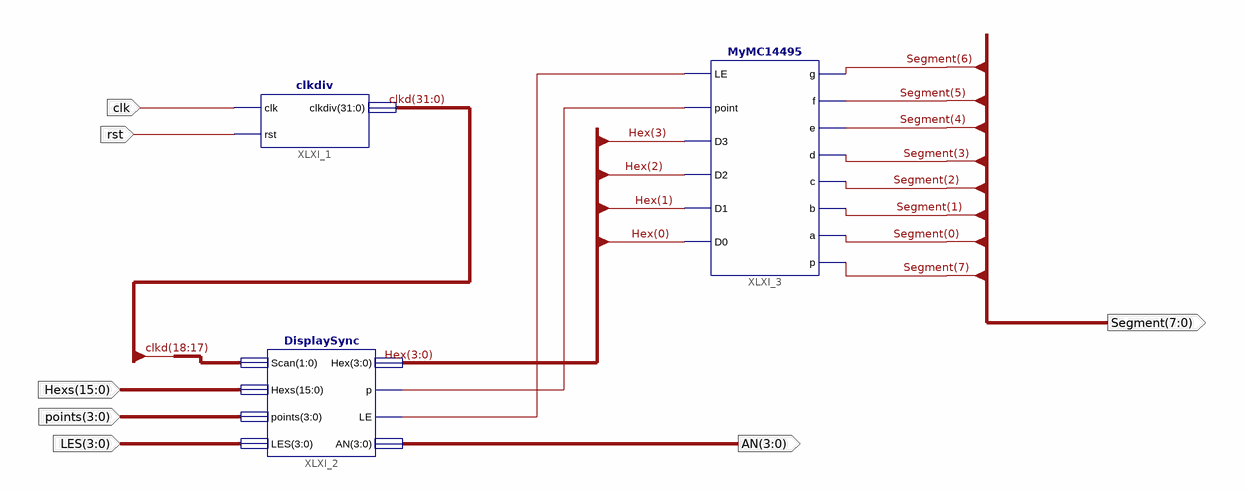
[diagram p0: schematic sheet 1]
// Xilinx ISE schematic DispNum.sch (kintex7) as structural Verilog: 3 symbols, 7 ports
module DispNum (
  input  clk,
  input  rst,
  input  [15:0] Hexs,
  input  [3:0] points,
  input  [3:0] LES,
  output [3:0] AN,
  output [7:0] Segment
);

  wire XLXN_9, XLXN_10;
  wire [3:0] Hex;
  wire [31:0] clkd;

  clkdiv XLXI_1 (.clk(clk), .rst(rst), .clkdiv(clkd));
  DisplaySync XLXI_2 (
    .Scan(clkd[18:17]), .Hexs(Hexs), .points(points), .LES(LES), .Hex(Hex), .p(XLXN_9), .LE(XLXN_10), .AN(AN));
  MyMC14495 XLXI_3 (
    .LE(XLXN_10), .point(XLXN_9), .D3(Hex[3]), .D2(Hex[2]), .D1(Hex[1]), .D0(Hex[0]), .g(Segment[6]),
    .f(Segment[5]), .e(Segment[4]), .d(Segment[3]), .c(Segment[2]), .b(Segment[1]), .a(Segment[0]),
    .p(Segment[7]));
endmodule
